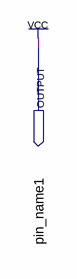
[diagram p0: schematic sheet]
// Quartus schematic fpga-quest.bdf as structural Verilog: 0 symbols, 1 pins
module \fpga-quest  (
  output pin_name1
);


  assign pin_name1 = 1'b1;
endmodule
